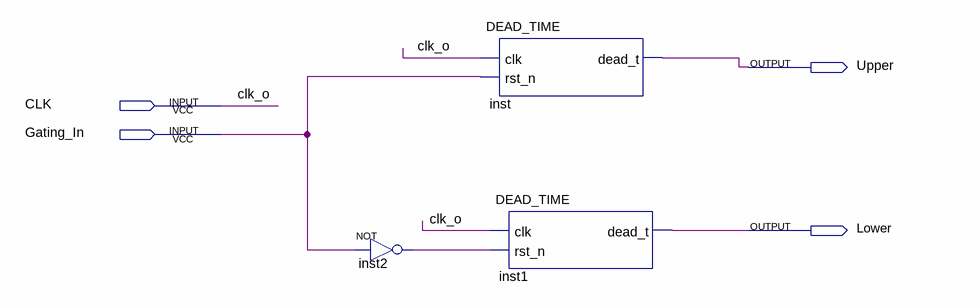
[diagram p0: schematic sheet]
// Quartus schematic DEADTIME_COM.bdf as structural Verilog: 3 symbols, 4 pins
module DEADTIME_COM (
  input  CLK,
  input  Gating_In,
  output Upper,
  output Lower
);

  wire inst2_out;

  not inst2 (inst2_out, Gating_In);
  DEAD_TIME inst (.clk(CLK), .rst_n(Gating_In), .dead_t(Upper));
  DEAD_TIME inst1 (.clk(CLK), .rst_n(inst2_out), .dead_t(Lower));

  // Other names for the same wires on the sheet: clk_o = CLK
endmodule
